# EAGLE design atiny13u-breakout (EAGLE 9.1.3)
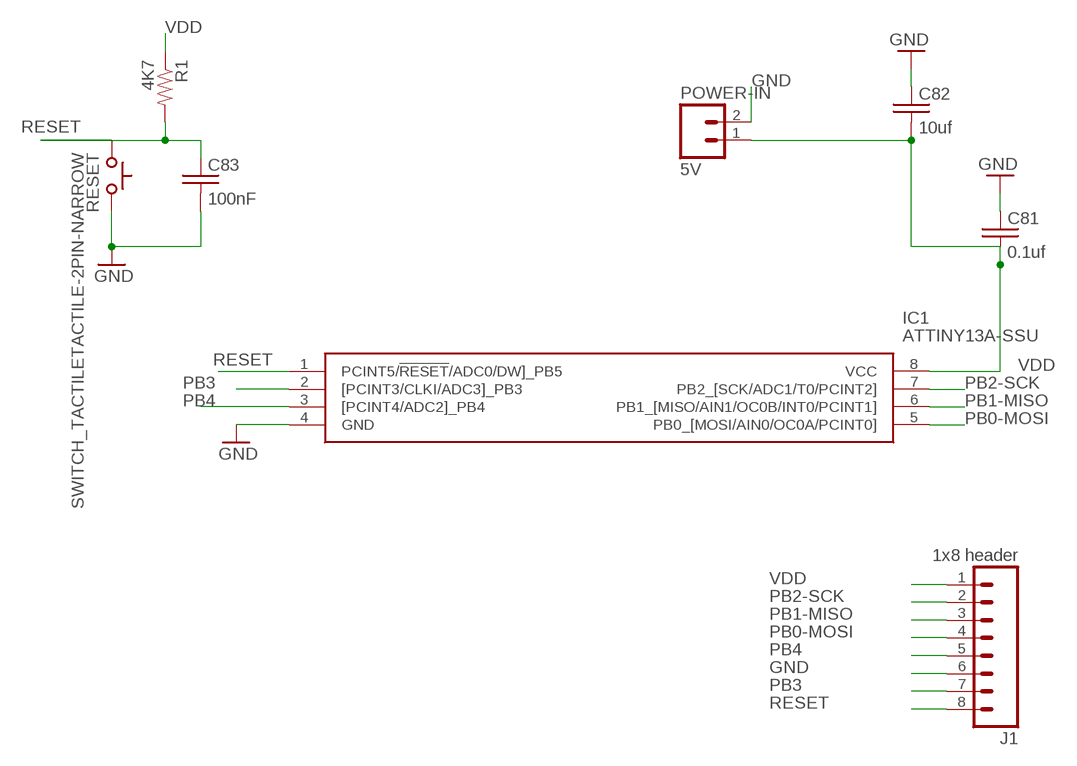
[diagram p0: schematic, sheet 1]

## Parts
C81  0.1uf  C-USC0805-VOLTERA  [C0805-VOLTA]
C82  10uf  C-USC0805-VOLTERA  [C0805-VOLTA]
C83  100nF  C-USC0805-VOLTERA  [C0805-VOLTA]
IC1  ATTINY13A-SSU  [SOIC127P600X175-8N]
J1  1x8 header  M08SILK_FEMALE_PTH  [1X08]
POWER-IN  5V  M02PTH  [1X02]
R1  4K7  RESISTOR0805-RES  [0805]
RESET  SWITCH_TACTILETACTILE-2PIN-NARROW  [TACTILE-2PIN-NARROW]

## Nets
GND: C81.1 C82.1 C83.2 IC1.4(GND) J1.6 POWER-IN.2 RESET.P$1(A)
PB0-MOSI: IC1.5(PB0_[MOSI/AIN0/OC0A/PCINT0]) J1.4
PB1-MISO: IC1.6(PB1_[MISO/AIN1/OC0B/INT0/PCINT1]) J1.3
PB2-SCK: IC1.7(PB2_[SCK/ADC1/T0/PCINT2]) J1.2
PB3: IC1.2([PCINT3/CLKI/ADC3]_PB3) J1.7
PB4: IC1.3([PCINT4/ADC2]_PB4) J1.5
RESET: C83.1 IC1.1(PCINT5/!RESET!/ADC0/DW]_PB5) J1.8 R1.2 RESET.P$2(C)
VDD: C81.2 C82.2 IC1.8(VCC) J1.1 POWER-IN.1 R1.1

## Library data of the parts
C81-C83 = name-in-lights:C-US: CAPACITOR, American symbol
IC1 = NameInLights:ATTINY13A-SSU: ATTINY13A-SSU, 8 bit AVR Microcontroller 20MHz 1, 64kB, B Flash, 64B RAM, SPI 8-Pin SOIC Source: Datasheet <http://www.atmel.com/images/doc8126.pdf>; ARROW_PART_NUMBER: ATTINY13A-SSU; ARROW_PRICE/STOCK: https://www.arrow.com/en/products/attiny13a-ssu/microchip-technology; DESCRIPTION: ATTINY13A-SSU, 8 bit AVR Microcontroller 20MHz 1, 64kB, B Flash, 64B RAM, SPI 8-Pin SOIC; HEIGHT: 1.75mm; MANUFACTURER_NAME: Microchip; MANUFACTURER_PART_NUMBER: ATTINY13A-SSU; RS_PART_NUMBER: 9214573; RS_PRICE/STOCK: http://uk.rs-online.com/web/p/products/9214573
J1 = NameInLights:M08: Header 8 Standard 8-pin 0.1" header. Use with straight break away headers (SKU : PRT-00116), right angle break away headers (PRT-00553), swiss pins (PRT-00743), machine pins (PRT-00117), and female headers (PRT-00115).; PROD_ID: CONN-08438
POWER-IN = name-in-lights:M02: Standard 2-pin 0.1" header. Use with - straight break away headers ( PRT-00116) - right angle break away headers (PRT-00553) - swiss pins (PRT-00743) - machine pins (PRT-00117) - female headers (PRT-00115) Molex polarized connector foot print use with: PRT-08233 with associated crimp pins and housings. 2.54_SCREWTERM for use with PRT-10571. 3.5mm Screw Terminal footprints for PRT-08084 5mm Screw Terminal footprints for use with PRT-08432
R1 = NameInLights:RESISTOR: Resistor Basic schematic elements and footprints for 0603, 1206, and PTH resistors.
RESET = NameInLights:SWITCH_TACTILE

## Board
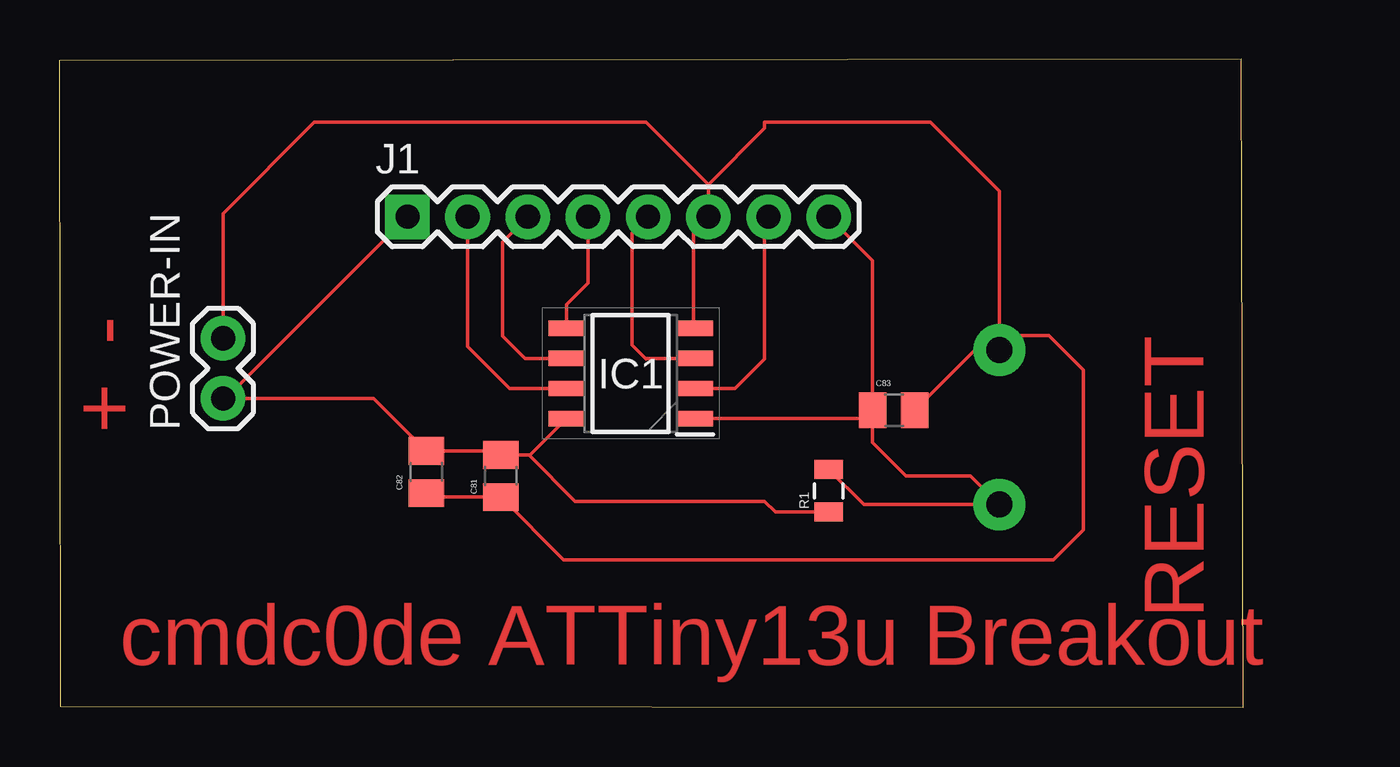
[diagram p1: board, top side]
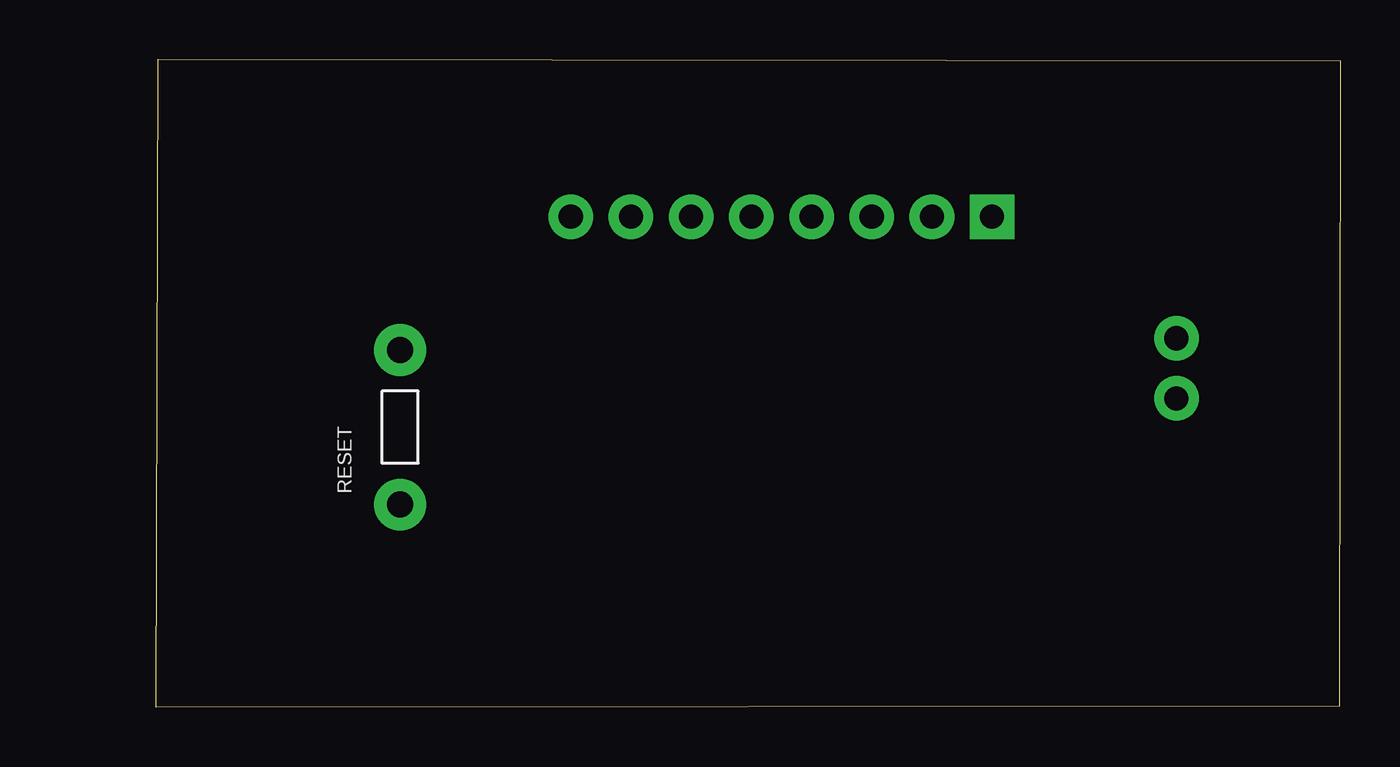
[diagram p2: board, bottom side, seen from below]

Size 49.96 x 27.36 mm. Coordinates in mm from the lower left corner, seen from the top.
Outline: 0.04,0.04 49.96,0 49.89,27.36 0,27.31 0.04,0.04
Copper layers (1*16): Top 0.035mm / dielectric 1.5mm / Bottom 0.035mm
Design rules "default": minimum track width 6mil, minimum drill 0.35mm, track to track 6mil, track to pad 6mil, pad to pad 6mil, via to via 6mil, smd to smd 6mil, copper to edge 40mil, drill to drill 6mil, minimum pad ring 10mil, minimum via ring 8mil, stop-mask expansion 4mil, vias tented up to drill 0mil, thermal gap 10mil

### Footprints (pad centres in the part's own frame; a part is rotated, then mirrored left to right if it is on the bottom)
C0805-VOLTA = smd 1.168 x 1.499: 1 -0.889,0; 2 0.889,0
SOIC127P600X175-8N = smd 1.525 x 0.65: 1 -2.712,1.905; 2 -2.712,0.635; 3 -2.712,-0.635; 4 -2.712,-1.905; 5 2.712,-1.905; 6 2.712,-0.635; 7 2.712,0.635; 8 2.712,1.905
1X08 = drill 1.016 pad 1.88 square: 1 0,0 | drill 1.016 pad 1.88: 2 2.54,0; 3 5.08,0; 4 7.62,0; 5 10.16,0; 6 12.7,0; 7 15.24,0; 8 17.78,0
1X02 = drill 1.016 pad 1.88: 1 0,0; 2 2.54,0
0805 = smd 0.8 x 1.2: 1 -0.9,0; 2 0.9,0
TACTILE-2PIN-NARROW = drill 1.1 pad 2.184: P$1 3.264,0; P$2 -3.264,0

### Placement (x,y rotation side)
C81  18.64,9.77 90 top
C82  15.49,9.94 90 top
C83  35.22,12.55 0 top
IC1  24.12,14.1 180 top
J1  14.69,20.72 0 top
POWER-IN  6.91,13.05 90 top
R1  32.47,9.15 90 top
RESET  39.68,11.83 90 bottom

### Tracks (layer width: path | path; a pad name or v marks a point on that pad's centre or on a via)
GND
  Top 0.152: IC1.4 26.77,16.07 26.77,20.09 J1.6 27.39,22.08 | POWER-IN.2 6.91,15.71 6.91,20.85 10.77,24.71 24.77,24.71 27.39,22.08 | RESET.P$1 39.68,21.8 36.77,24.71 29.77,24.71 29.77,24.45 27.39,22.08 | C83.2 38.65,15.09 RESET.P$1 | C82.1 15.66,8.88 C81.1 21.28,6.23 41.96,6.23 43.22,7.5 43.22,14.25 41.77,15.71 40.29,15.71 RESET.P$1
PB0-MOSI
  Top 0.152: J1.4 22.31,17.91 21.4,17 IC1.5
PB1-MISO
  Top 0.152: J1.3 18.71,19.65 18.71,15.68 19.65,14.73 IC1.6
PB2-SCK
  Top 0.152: J1.2 17.23,15.24 19.01,13.46 IC1.7
PB3
  Top 0.152: IC1.2 28.52,13.46 29.77,14.71 29.77,20.55 J1.7
PB4
  Top 0.152: IC1.3 24.79,14.73 24.77,14.71 24.17,15.3 24.17,20.03 J1.5
RESET
  Top 0.152: R1.2 33.95,8.56 RESET.P$2 38.46,9.78 35.73,9.78 34.33,11.19 C83.1 | C83.1 33.97,12.19 IC1.1 | C83.1 34.33,18.86 J1.8
VDD
  Top 0.152: C81.2 18.46,10.83 C82.2 13.27,13.05 POWER-IN.1 7.02,13.05 J1.1 | C81.2 19.87,10.66 IC1.8 | C81.2 19.82,10.66 | C81.2 19.82,10.66 | 19.82,10.66 21.77,8.71 29.77,8.71 30.23,8.25 R1.1

### Text on the board
Top: - | RESET | + | cmdc0de ATTiny13u Breakout